# Altium schematic sheet LM386.SchDoc
size A4
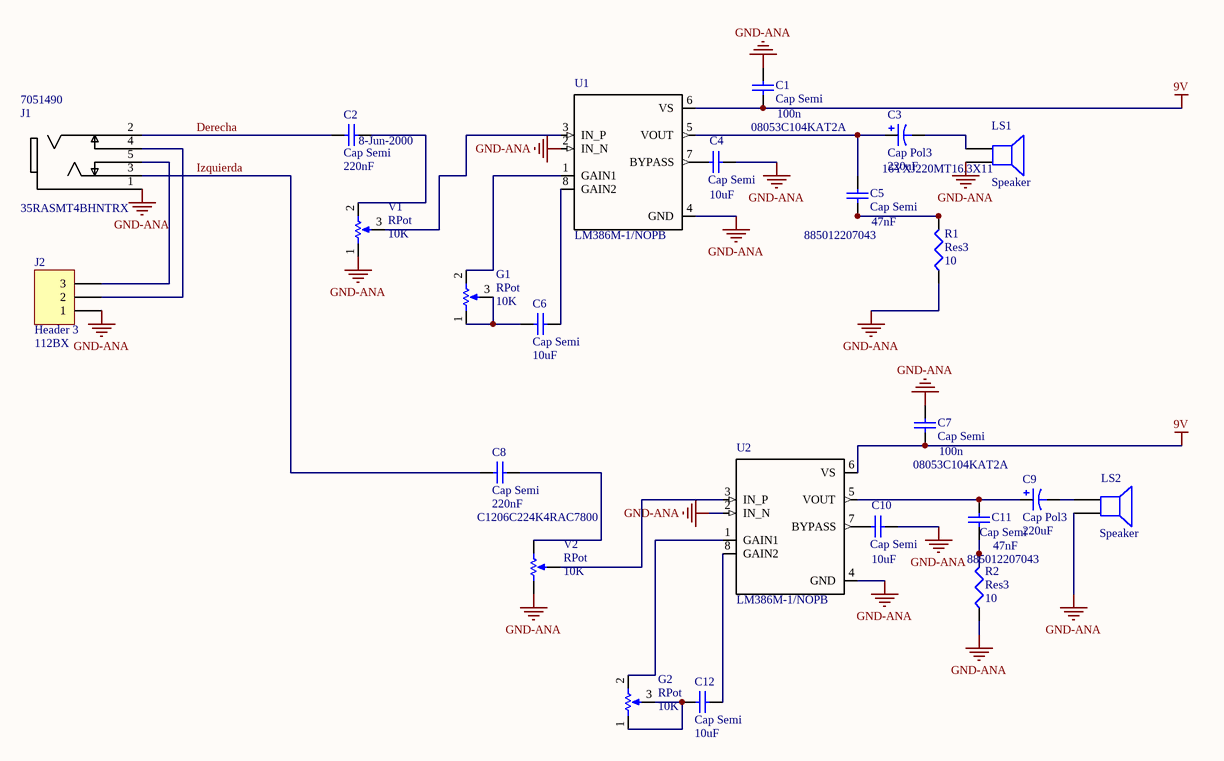
[diagram p0: LM386.SchDoc]

## Parts
C1  Cap Semi  value 100n  PN: 08053C104KAT2A  [C0805]
C2  Cap Semi  value 220nF  Published: 8-Jun-2000  [C1206]
C3  Cap Pol3  value 220uF  PN: 16YXJ220MT16.3X11  [C0805]
C4  Cap Semi  value 10uF  [C1206]
C5  Cap Semi  value 47nF  PN: 885012207043  [C0805]
C6  Cap Semi  value 10uF  [C0805]
C7  Cap Semi  value 100n  PN: 08053C104KAT2A  [C0805]
C8  Cap Semi  value 220nF  PN: C1206C224K4RAC7800  [C1206]
C9  Cap Pol3  value 220uF  [C0805]
C10  Cap Semi  value 10uF  [C0805]
C11  Cap Semi  value 47nF  PN: 885012207043  [C0805]
C12  Cap Semi  value 10uF  [C0805]
G1  RPot  value 10K  [Potenciometer]
G2  RPot  value 10K  [Potenciometer]
J1  35RASMT4BHNTRX  Supplier Part Number 1: 7051490  [SWITCHCRAFT_35RASMT4BHNTRX]
J2  Header 3  PN: 112BX  [HDR1X3]
LS1  Speaker  [PIN2]
LS2  Speaker  [PIN2]
R1  Res3  value 10  [SMD-0805-RES]
R2  Res3  value 10  [SMD-0805-RES]
U1  LM386M-1/NOPB  [SOIC127P600X175-8N]
U2  LM386M-1/NOPB  [SOIC127P600X175-8N]
V1  RPot  value 10K  [Potenciometer]
V2  RPot  value 10K  [Potenciometer]

## Nets
9V: C1.2 C7.2 U1.6(VS) U2.6(VS)
GND-ANA: C1.1 C4.1 C7.1 C10.1 J1.1 J2.1 LS1.2 LS2.2 R1.1 R2.1 U1.2(IN_N) U1.4(GND) U2.2(IN_N) U2.4(GND) V1.1(TOP) V2.1(TOP)
Derecha: C2.2 J1.2
Izquierda: C8.2 J1.3
NetC2_1: C2.1 V1.2(BOT)
NetC3_1: C3.1 C5.1 U1.5(VOUT)
NetC3_2: C3.2 LS1.1
NetC4_2: C4.2 U1.7(BYPASS)
NetC5_2: C5.2 R1.2
NetC6_1: C6.1 U1.8(GAIN2)
NetC6_2: C6.2 G1.1(TOP) G1.3(TAP)
NetC8_1: C8.1 V2.2(BOT)
NetC9_1: C9.1 C11.1 U2.5(VOUT)
NetC9_2: C9.2 LS2.1
NetC10_2: C10.2 U2.7(BYPASS)
NetC11_2: C11.2 R2.2
NetC12_1: C12.1 U2.8(GAIN2)
NetC12_2: C12.2 G2.1(TOP) G2.3(TAP)
NetG1_2: G1.2(BOT) U1.1(GAIN1)
NetG2_2: G2.2(BOT) U2.1(GAIN1)
NetJ1_4: J1.4 J2.2
NetJ1_5: J1.5 J2.3
NetU1_3: U1.3(IN_P) V1.3(TAP)
NetU2_3: U2.3(IN_P) V2.3(TAP)

## Library data of the parts
C1 C5 C7 C8 C11 = Cap Semi: Capacitor (Semiconductor SIM Model); Published: 8-Jun-2000; LatestRevisionDate: 29-May-2009; LatestRevisionNote: IPC-7351 Footprint Added.; PackageReference: C1206; Publisher: Altium Limited; PackageDescription: Chip Capacitor
C2 = Cap Semi: Capacitor (Semiconductor SIM Model); PN: C1206C224K4RAC7800; LatestRevisionDate: 29-May-2009; LatestRevisionNote: IPC-7351 Footprint Added.; PackageReference: C1206; Publisher: Altium Limited; PackageDescription: Chip Capacitor
C3 = Cap Pol3: Polarized Capacitor (Surface Mount); Published: 8-Jun-2000; LatestRevisionDate: 29-May-2009; LatestRevisionNote: IPC-7351 Footprint Added.; PackageReference: C0805; Publisher: Altium Limited; PackageDescription: Chip Capacitor; Supplier 1: Mouser; Supplier Part Number 1: 581-TAJC227K010RNJ
C4 = Cap Semi: Capacitor (Semiconductor SIM Model); PN: CL31B106MOHNNNE; Published: 8-Jun-2000; LatestRevisionDate: 29-May-2009; LatestRevisionNote: IPC-7351 Footprint Added.; PackageReference: C1206; Publisher: Altium Limited; PackageDescription: Chip Capacitor
C6 C10 C12 = Cap Semi: Capacitor (Semiconductor SIM Model); PN: CL21A106KOCLRNC; Published: 8-Jun-2000; LatestRevisionDate: 29-May-2009; LatestRevisionNote: IPC-7351 Footprint Added.; Publisher: Altium Limited; PackageDescription: Chip Capacitor
  C6 C12: PackageReference: C1206
  C10: PackageReference: C0805
C9 = Cap Pol3: Polarized Capacitor (Surface Mount); PN: 16YXJ220MT16.3X11; Published: 8-Jun-2000; LatestRevisionDate: 29-May-2009; LatestRevisionNote: IPC-7351 Footprint Added.; PackageReference: C0805; Publisher: Altium Limited; PackageDescription: Chip Capacitor
G1 G2 V2 = RPot: Potentiometer; pin to pad: 2>3 3>2; PN: P160KN-0QC20A10K; Set Position: 0.5; Published: 8-Jun-2000; LatestRevisionDate: 17-Jul-2002; LatestRevisionNote: Re-released for DXP Platform.; PackageReference: VR5; Publisher: Altium Limited; PackageDescription: Variable Resistor, Thru-Hole; 3 Leads
J1 = 35RASMT4BHNTRX: Conn 3.5MM Stereo Jack F 3 POS Solder RA SMD 5 Terminal 1 Port T/R; MF: Switchcraft; Package: None; PN: 35RASMT4BHNTRX; SnapEDA_Link: https://www.snapeda.com/parts/35RASMT4BHNTRX/Switchcraft%20Inc./view-part/?ref=snap; Availability: Unavailable; Price: None; Value: *; Supplier 1: RSComponents
J2 = Header 3: Header, 3-Pin; LatestRevisionDate: 17-Jul-2002; LatestRevisionNote: Re-released for DXP Platform.; Publisher: Altium Limited
LS1 LS2 = Speaker: Loudspeaker; Published: 24-Mar-1999; LatestRevisionDate: 17-Jul-2002; LatestRevisionNote: Re-released for DXP Platform.; PackageReference: PIN2; Publisher: Altium Limited
R1 R2 = Res3: Resistor; PN: RNCP0805FTD10R0; Published: 8-Jun-2000; LatestRevisionDate: 29-May-2009; LatestRevisionNote: IPC-7351 Footprint Added.; PackageReference: J1-0603; Publisher: Altium Limited; PackageDescription: Chip Resistor
U1 U2 = LM386M-1/NOPB: Wide Input Voltage Low Power Audio Amplifier with Internal Gain 8-SOIC 0 to 70; MF: Texas Instruments; Price: 0.76 USD; PN: LM386M-1/NOPB; Availability: Good; SnapEDA_Link: https://www.snapeda.com/parts/LM386M-1/Texas%20Instruments/view-part/?ref=snap; Package: SOIC-8 Texas Instruments; Supplier 1: RSComponents
V1 = RPot: Potentiometer; PN: P160KN-0QC20A10K; Set Position: 0.5; Published: 8-Jun-2000; LatestRevisionDate: 17-Jul-2002; LatestRevisionNote: Re-released for DXP Platform.; PackageReference: VR5; Publisher: Altium Limited; PackageDescription: Variable Resistor, Thru-Hole; 3 Leads